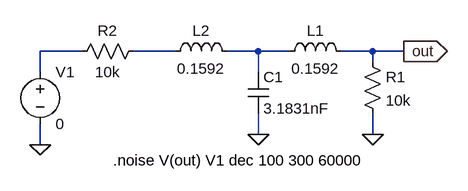
[diagram p0: schematic Draft7.asc]
Draft7.asc, the LTspice schematic file:
Version 4
SHEET 1 880 680
WIRE -80 112 -144 112
WIRE 64 112 0 112
WIRE 192 112 144 112
WIRE 240 112 192 112
WIRE 368 112 320 112
WIRE 416 112 368 112
WIRE 368 128 368 112
WIRE -144 144 -144 112
WIRE 192 144 192 112
WIRE 192 240 192 208
WIRE 368 240 368 208
WIRE -144 256 -144 224
FLAG 192 240 0
FLAG 368 240 0
FLAG -144 256 0
FLAG 416 112 out
IOPIN 416 112 Out
SYMBOL cap 176 144 R0
SYMATTR InstName C1
SYMATTR Value 3.1831nF
SYMBOL res 352 112 R0
SYMATTR InstName R1
SYMATTR Value 10k
SYMBOL ind 224 128 R270
WINDOW 0 32 56 VTop 2
WINDOW 3 5 56 VBottom 2
SYMATTR InstName L1
SYMATTR Value 0.1592
SYMBOL ind 48 128 R270
WINDOW 0 32 56 VTop 2
WINDOW 3 5 56 VBottom 2
SYMATTR InstName L2
SYMATTR Value 0.1592
SYMBOL voltage -144 128 R0
WINDOW 123 0 0 Left 0
WINDOW 39 0 0 Left 0
SYMATTR InstName V1
SYMATTR Value 0
SYMBOL res -96 128 R270
WINDOW 0 32 56 VTop 2
WINDOW 3 0 56 VBottom 2
SYMATTR InstName R2
SYMATTR Value 10k
TEXT -32 280 Left 2 !.noise V(out) V1 dec 100 300 60000

The netlist it stands for:
* Draft7.asc
C1 N003 0 3.1831nF
R1 out 0 10k
L1 N003 out 0.1592
L2 N002 N003 0.1592
V1 N001 0 0
R2 N001 N002 10k
.noise V(out) V1 dec 100 300 60000
.backanno
.end